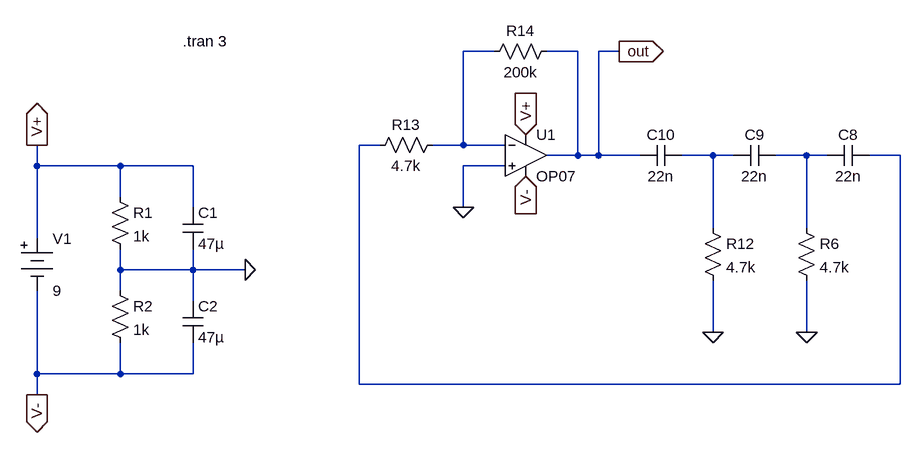
[diagram p0: schematic 540hz-phase-shift-oscillator.asc]
540hz-phase-shift-oscillator.asc, the LTspice schematic file:
Version 4
SHEET 1 2352 1448
WIRE 384 -144 336 -144
WIRE 512 -144 464 -144
WIRE 576 -144 544 -144
WIRE 208 0 176 0
WIRE 336 0 336 -144
WIRE 336 0 288 0
WIRE 400 0 336 0
WIRE 512 16 512 -144
WIRE 512 16 464 16
WIRE 544 16 544 -144
WIRE 544 16 512 16
WIRE 608 16 544 16
WIRE 720 16 672 16
WIRE 752 16 720 16
WIRE 864 16 816 16
WIRE 896 16 864 16
WIRE 1008 16 960 16
WIRE -320 32 -320 0
WIRE -192 32 -320 32
WIRE -80 32 -192 32
WIRE 400 32 336 32
WIRE -192 80 -192 32
WIRE -80 96 -80 32
WIRE 336 96 336 32
WIRE 720 128 720 16
WIRE 864 128 864 16
WIRE -320 144 -320 32
WIRE -192 192 -192 160
WIRE -80 192 -80 160
WIRE -80 192 -192 192
WIRE 0 192 -80 192
WIRE -192 224 -192 192
WIRE -80 240 -80 192
WIRE 720 288 720 208
WIRE 864 288 864 208
WIRE -320 352 -320 224
WIRE -192 352 -192 304
WIRE -192 352 -320 352
WIRE -80 352 -80 304
WIRE -80 352 -192 352
WIRE 176 368 176 0
WIRE 1008 368 1008 16
WIRE 1008 368 176 368
WIRE -320 384 -320 352
FLAG -320 0 V+
IOPIN -320 0 Out
FLAG 864 288 0
FLAG 720 288 0
FLAG 336 96 0
FLAG 432 -16 V+
IOPIN 432 -16 In
FLAG 432 48 V-
IOPIN 432 48 In
FLAG 576 -144 out
IOPIN 576 -144 Out
FLAG -320 384 V-
IOPIN -320 384 Out
FLAG 0 192 0
SYMBOL Misc\\battery -320 128 R0
WINDOW 123 0 0 Left 0
WINDOW 39 0 0 Left 0
SYMATTR InstName V1
SYMATTR Value 9
SYMBOL OpAmps\\OP07 432 -48 R0
SYMATTR InstName U1
SYMBOL cap 960 0 R90
WINDOW 0 0 32 VBottom 2
WINDOW 3 32 32 VTop 2
SYMATTR InstName C8
SYMATTR Value 22n
SYMBOL cap 816 0 R90
WINDOW 0 0 32 VBottom 2
WINDOW 3 32 32 VTop 2
SYMATTR InstName C9
SYMATTR Value 22n
SYMBOL cap 672 0 R90
WINDOW 0 0 32 VBottom 2
WINDOW 3 32 32 VTop 2
SYMATTR InstName C10
SYMATTR Value 22n
SYMBOL res 848 112 R0
SYMATTR InstName R6
SYMATTR Value 4.7k
SYMBOL res 704 112 R0
SYMATTR InstName R12
SYMATTR Value 4.7k
SYMBOL res 304 -16 R90
WINDOW 0 0 56 VBottom 2
WINDOW 3 32 56 VTop 2
SYMATTR InstName R13
SYMATTR Value 4.7k
SYMBOL res 480 -160 R90
WINDOW 0 0 56 VBottom 2
WINDOW 3 32 56 VTop 2
SYMATTR InstName R14
SYMATTR Value 200k
SYMBOL res -208 64 R0
SYMATTR InstName R1
SYMATTR Value 1k
SYMBOL res -208 208 R0
SYMATTR InstName R2
SYMATTR Value 1k
SYMBOL cap -96 96 R0
SYMATTR InstName C1
SYMATTR Value 47µ
SYMBOL cap -96 240 R0
SYMATTR InstName C2
SYMATTR Value 47µ
TEXT -96 -160 Left 2 !.tran 3

The netlist it stands for:
* 540hz-phase-shift-oscillator.asc
V1 V+ V- 9
XU1 0 N001 V+ V- out LT1001  ; OP07, pins In+ In- V+ V- OUT
C8 N002 N004 22n
C9 N004 N003 22n
C10 N003 out 22n
R6 N004 0 4.7k
R12 N003 0 4.7k
R13 N001 N002 4.7k
R14 out N001 200k
R1 V+ 0 1k
R2 0 V- 1k
C1 V+ 0 47µ
C2 0 V- 47µ
.tran 3
.lib LTC.lib
.backanno
.end